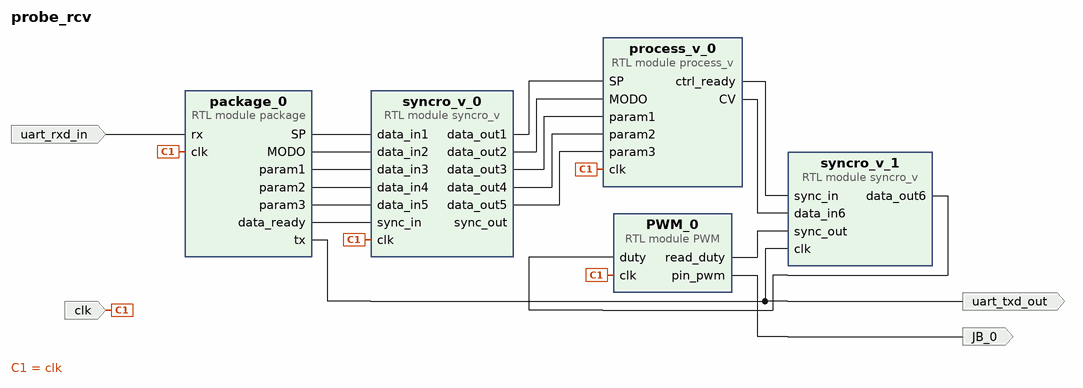
[diagram p0: block diagram of the top level]
# Vivado block design probe_rcv, Vivado 2016.1
create_bd_design probe_rcv

create_bd_port -dir I -type clk clk
create_bd_port -dir I uart_rxd_in
create_bd_port -dir O uart_txd_out
create_bd_port -dir O JB_0

create_bd_cell -type module -reference syncro_v syncro_v_0
create_bd_cell -type module -reference package package_0
create_bd_cell -type module -reference PWM PWM_0
create_bd_cell -type module -reference process_v process_v_0
create_bd_cell -type module -reference syncro_v syncro_v_1

# ---- connections ----

connect_bd_net [get_bd_ports clk] [get_bd_pins syncro_v_0/clk] [get_bd_pins package_0/clk] [get_bd_pins PWM_0/clk] [get_bd_pins process_v_0/clk]
connect_bd_net -net rx_1 [get_bd_ports uart_rxd_in] [get_bd_pins package_0/rx]
connect_bd_net [get_bd_pins package_0/tx] [get_bd_ports uart_txd_out] [get_bd_pins syncro_v_1/clk]
connect_bd_net [get_bd_pins PWM_0/pin_pwm] [get_bd_ports JB_0]
# net process_v_0_read_data has one end: syncro_v_0/sync_out
connect_bd_net [get_bd_pins process_v_0/ctrl_ready] [get_bd_pins syncro_v_1/sync_in]
connect_bd_net [get_bd_pins package_0/SP] [get_bd_pins syncro_v_0/data_in1]
connect_bd_net [get_bd_pins package_0/MODO] [get_bd_pins syncro_v_0/data_in2]
connect_bd_net [get_bd_pins package_0/param1] [get_bd_pins syncro_v_0/data_in3]
connect_bd_net [get_bd_pins package_0/param2] [get_bd_pins syncro_v_0/data_in4]
connect_bd_net [get_bd_pins package_0/param3] [get_bd_pins syncro_v_0/data_in5]
connect_bd_net [get_bd_pins syncro_v_0/data_out1] [get_bd_pins process_v_0/SP]
connect_bd_net [get_bd_pins syncro_v_0/data_out2] [get_bd_pins process_v_0/MODO]
connect_bd_net [get_bd_pins syncro_v_0/data_out3] [get_bd_pins process_v_0/param1]
connect_bd_net [get_bd_pins syncro_v_0/data_out4] [get_bd_pins process_v_0/param2]
connect_bd_net [get_bd_pins syncro_v_0/data_out5] [get_bd_pins process_v_0/param3]
connect_bd_net [get_bd_pins package_0/data_ready] [get_bd_pins syncro_v_0/sync_in]
connect_bd_net [get_bd_pins PWM_0/read_duty] [get_bd_pins syncro_v_1/sync_out]
connect_bd_net [get_bd_pins process_v_0/CV] [get_bd_pins syncro_v_1/data_in6]
connect_bd_net [get_bd_pins syncro_v_1/data_out6] [get_bd_pins PWM_0/duty]

validate_bd_design
save_bd_design
